# EAGLE design Microport_Dev_Board (EAGLE 8.3.2)

## Sheet 1 of 2
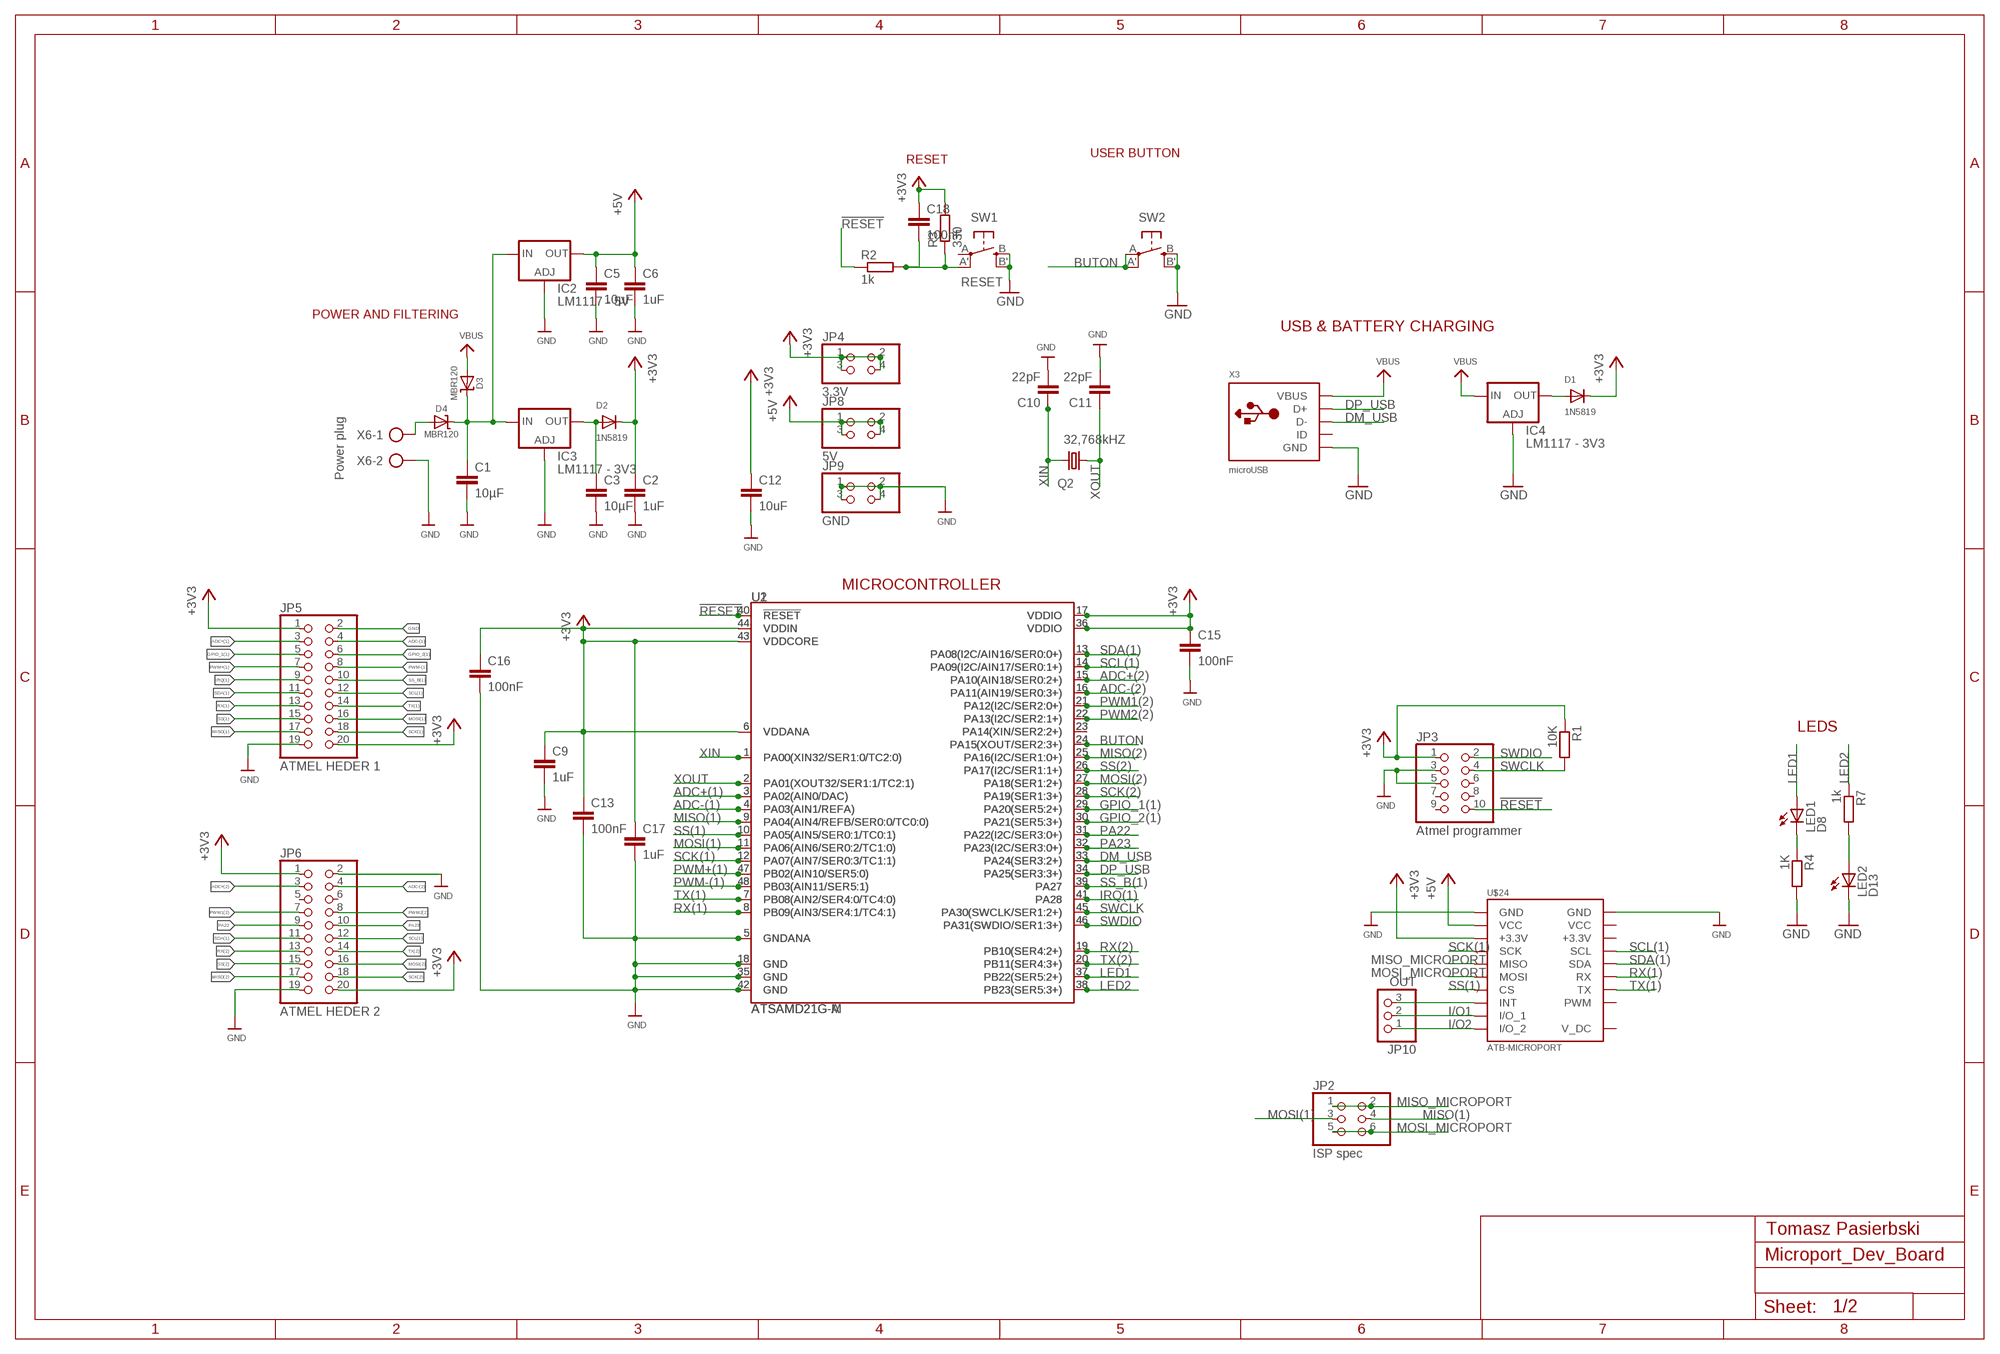
[diagram p0: schematic, sheet 1]

### Parts
C1  10µF  C-EUC1206  [C1206]
C2  1uF  C-EUC1206  [C1206]
C3  10µF  C-EUC1206  [C1206]
C5  10µF  C-EUC1206  [C1206]
C6  1uF  C-EUC1206  [C1206]
C9  1uF  C-EUC1206  [C1206]
C10  22pF  C-EUC1206  [C1206]
C11  22pF  C-EUC1206  [C1206]
C12  10uF  C-EUC1206  [C1206]
C13  100nF  C-EUC1206  [C1206]
C15  100nF  C-EUC1206  [C1206]
C16  100nF  C-EUC1206  [C1206]
C17  1uF  C-EUC1206  [C1206]
C18  100nF  C-EUC1206  [C1206]
D1  1N5819  DIODESOD-523  [SOD-523]
D2  1N5819  DIODESOD-523  [SOD-523]
D3  MBR120  DIODE-SCHOTTKYSOD-123  [SOD-123]
D4  MBR120  DIODE-SCHOTTKYSOD-123  [SOD-123]
IC2  LM1117 - 5V  LD117AS33TR  [SOT223]
IC3  LM1117 - 3V3  LD117AS33TR  [SOT223]
IC4  LM1117 - 3V3  LD117AS33TR  [SOT223]
JP2  ISP spec  PINHD-2X3  [2X03]
JP3  Atmel programmer  PINHD-2X5  [2X05]
JP4  3.3V  PINHD-2X2  [2X02]
JP5  ATMEL HEDER 1  PINHD-2X10  [2X10]
JP6  ATMEL HEDER 2  PINHD-2X10  [2X10]
JP8  5V  PINHD-2X2  [2X02]
JP9  GND  PINHD-2X2  [2X02]
JP10  OUT  PINHD-1X3  [1X03]
LED1  D8  LEDSMT1206  [1206]
LED2  D13  LEDSMT1206  [1206]
Q2  32,768kHZ  CRYSTALHC49UP  [HC49UP]
R1  10K  R-EU_M1206  [M1206]
R2  1k  R-EU_R1206  [R1206]
R3  330  R-EU_R1206  [R1206]
R4  1K  R-EU_M1206  [M1206]
R7  1k  R-EU_M1206  [M1206]
SW1  RESET  SPST_TACT-EVQQ2  [EVQ-Q2]
SW2  USER BUTTON  SPST_TACT-EVQQ2  [EVQ-Q2]
U1  ATSAMD21G-M  [QFN-48]
U2  ATSAMD21G-A  [TQFP-48]
U$24  ATB-MICROPORT  [ATB-MICROPORT]
X3  microUSB  USBMINIB  [USB-MINIB]
X6  Power plug  AK300/2  [AK300/2]

### Nets
!RESET: JP3.10 R2.1 U1.40(!RESET!) U2.40(!RESET!) ; also sheet 2
+3V3: C2.1 C9.1 C12.1 C13.1 C15.1 C16.1 C17.1 C18.1 D1.K(C) D2.K(C) JP3.1 JP4.1 JP4.2 JP4.3 JP4.4 JP5.1 JP5.20 JP6.1 JP6.20 R1.1 R3.2 U1.17(VDDIO) U1.36(VDDIO) U2.6(VDDANA) U2.17(VDDIO) U2.36(VDDIO) U2.43(VDDCORE) U2.44(VDDIN) U$24.P$3(+3.3V) ; also sheet 2
+5V: C5.1 C6.1 IC2.4(OUT) JP8.1 JP8.2 JP8.3 JP8.4 U$24.P$2(VCC) ; also sheet 2
ADC+(1): JP5.3 U1.3(PA02(AIN0/DAC)) U2.3(PA02(AIN0/DAC))
ADC+(2): JP6.3 U1.15(PA10(AIN18/SER0:2+)) U2.15(PA10(AIN18/SER0:2+))
ADC-(1): JP5.4 U1.4(PA03(AIN1/REFA)) U2.4(PA03(AIN1/REFA))
ADC-(2): JP6.4 U1.16(PA11(AIN19/SER0:3+)) U2.16(PA11(AIN19/SER0:3+))
BUTON: SW2.A'(P1) SW2.A(P) U1.24(PA15(XOUT/SER2:3+)) U2.24(PA15(XOUT/SER2:3+))
DM_USB: U1.33(PA24(SER3:2+)) U2.33(PA24(SER3:2+)) X3.D- ; also sheet 2
DP_USB: U1.34(PA25(SER3:3+)) U2.34(PA25(SER3:3+)) X3.D+ ; also sheet 2
GND: C1.2 C2.2 C3.2 C5.2 C6.2 C9.2 C10.2 C11.2 C12.2 C13.2 C15.2 C16.2 C17.2 IC2.1(ADJ) IC3.1(ADJ) IC4.1(ADJ) JP3.3 JP3.5 JP5.2 JP5.19 JP6.2 JP6.19 JP9.1 JP9.2 JP9.3 JP9.4 LED2.C R4.2 SW1.B'(S1) SW1.B(S) SW2.B'(S1) SW2.B(S) U1.5(GNDANA) U1.18(GND) U1.35(GND) U1.42(GND) U2.5(GNDANA) U2.18(GND) U2.35(GND) U2.42(GND) U$24.P$1(GND) U$24.P$19(GND) X3.GND X6.2 ; also sheet 2
GPIO_1(1): JP5.5 U1.29(PA20(SER5:2+)) U2.29(PA20(SER5:2+))
GPIO_2(1): JP5.6 U1.30(PA21(SER5:3+)) U2.30(PA21(SER5:3+))
I/O1: JP10.2 U$24.P$9(I/O_1)
I/O2: JP10.1 U$24.P$10(I/O_2)
IRQ(1): JP5.9 U1.41(PA28) U2.41(PA28)
LED1: LED1.A U1.37(PB22(SER5:2+)) U2.37(PB22(SER5:2+))
LED2: R7.1 U1.38(PB23(SER5:3+)) U2.38(PB23(SER5:3+))
MISO(1): JP2.4 JP5.17 U1.9(PA04(AIN4/REFB/SER0:0/TC0:0)) U2.9(PA04(AIN4/REFB/SER0:0/TC0:0))
MISO(2): JP6.17 U1.25(PA16(I2C/SER1:0+)) U2.25(PA16(I2C/SER1:0+))
MISO_MICROPORT: JP2.1 JP2.2 U$24.P$5(MISO)
MOSI(1): JP2.3 JP5.16 U1.11(PA06(AIN6/SER0:2/TC1:0)) U2.11(PA06(AIN6/SER0:2/TC1:0))
MOSI(2): JP6.16 U1.27(PA18(SER1:2+)) U2.27(PA18(SER1:2+))
MOSI_MICROPORT: JP2.5 JP2.6 U$24.P$6(MOSI)
N$2: LED2.A R7.2
N$3: C1.1 D3.C D4.C IC2.3(IN) IC3.3(IN)
N$5: D1.A IC4.4(OUT)
N$6: LED1.C R4.1
N$8: D4.A X6.1
N$9: C3.1 D2.A IC3.4(OUT)
N$10: C18.2 R2.2 R3.1 SW1.A'(P1)
N$14: JP10.3 U$24.P$8(INT)
N$39: U1.23(PA14(XIN/SER2:2+)) U2.23(PA14(XIN/SER2:2+))
PA22: JP6.9 U1.31(PA22(I2C/SER3:0+)) U2.31(PA22(I2C/SER3:0+))
PA23: JP6.10 U1.32(PA23(I2C/SER3:0+)) U2.32(PA23(I2C/SER3:0+))
PWM1(2): JP6.7 U1.21(PA12(I2C/SER2:0+)) U2.21(PA12(I2C/SER2:0+))
PWM2(2): JP6.8 U1.22(PA13(I2C/SER2:1+)) U2.22(PA13(I2C/SER2:1+))
PWM+(1): JP5.7 U1.47(PB02(AIN10/SER5:0)) U2.47(PB02(AIN10/SER5:0))
PWM-(1): JP5.8 U1.48(PB03(AIN11/SER5:1)) U2.48(PB03(AIN11/SER5:1))
RX(1): JP5.13 U1.8(PB09(AIN3/SER4:1/TC4:1)) U2.8(PB09(AIN3/SER4:1/TC4:1)) U$24.P$14(RX) ; also sheet 2
RX(2): JP6.13 U1.19(PB10(SER4:2+)) U2.19(PB10(SER4:2+))
SCK(1): JP5.18 U1.12(PA07(AIN7/SER0:3/TC1:1)) U2.12(PA07(AIN7/SER0:3/TC1:1)) U$24.P$4(SCK)
SCK(2): JP6.18 U1.28(PA19(SER1:3+)) U2.28(PA19(SER1:3+))
SCL(1): JP5.12 JP6.12 U1.14(PA09(I2C/AIN17/SER0:1+)) U2.14(PA09(I2C/AIN17/SER0:1+)) U$24.P$16(SCL) ; also sheet 2
SDA(1): JP5.11 JP6.11 U1.13(PA08(I2C/AIN16/SER0:0+)) U2.13(PA08(I2C/AIN16/SER0:0+)) U$24.P$15(SDA) ; also sheet 2
SS(1): JP5.15 U1.10(PA05(AIN5/SER0:1/TC0:1)) U2.10(PA05(AIN5/SER0:1/TC0:1)) U$24.P$7(CS)
SS(2): JP6.15 U1.26(PA17(I2C/SER1:1+)) U2.26(PA17(I2C/SER1:1+))
SS_B(1): JP5.10 U1.39(PA27) U2.39(PA27)
SWCLK: JP3.4 R1.2 U1.45(PA30(SWCLK/SER1:2+)) U2.45(PA30(SWCLK/SER1:2+))
SWDIO: JP3.2 U1.46(PA31(SWDIO/SER1:3+)) U2.46(PA31(SWDIO/SER1:3+))
TX(1): JP5.14 U1.7(PB08(AIN2/SER4:0/TC4:0)) U2.7(PB08(AIN2/SER4:0/TC4:0)) U$24.P$13(TX) ; also sheet 2
TX(2): JP6.14 U1.20(PB11(SER4:3+)) U2.20(PB11(SER4:3+))
VBUS: D3.A IC4.3(IN) X3.VBUS ; also sheet 2
XIN: C10.1 Q2.2 U1.1(PA00(XIN32/SER1:0/TC2:0)) U2.1(PA00(XIN32/SER1:0/TC2:0))
XOUT: C11.1 Q2.1 U1.2(PA01(XOUT32/SER1:1/TC2:1)) U2.2(PA01(XOUT32/SER1:1/TC2:1))
Unconnected: JP3.6 JP3.7 JP3.8 JP3.9 JP6.5 JP6.6 SW1.A(P) U1.6(VDDANA) U1.43(VDDCORE) U1.44(VDDIN) U$24.P$12(PWM) X3.ID

### Notes on the sheet
- RESET
- POWER AND FILTERING
- USB & BATTERY CHARGING
- MICROCONTROLLER
- LEDS
- Tomasz Pasierbski

## Sheet 2 of 2
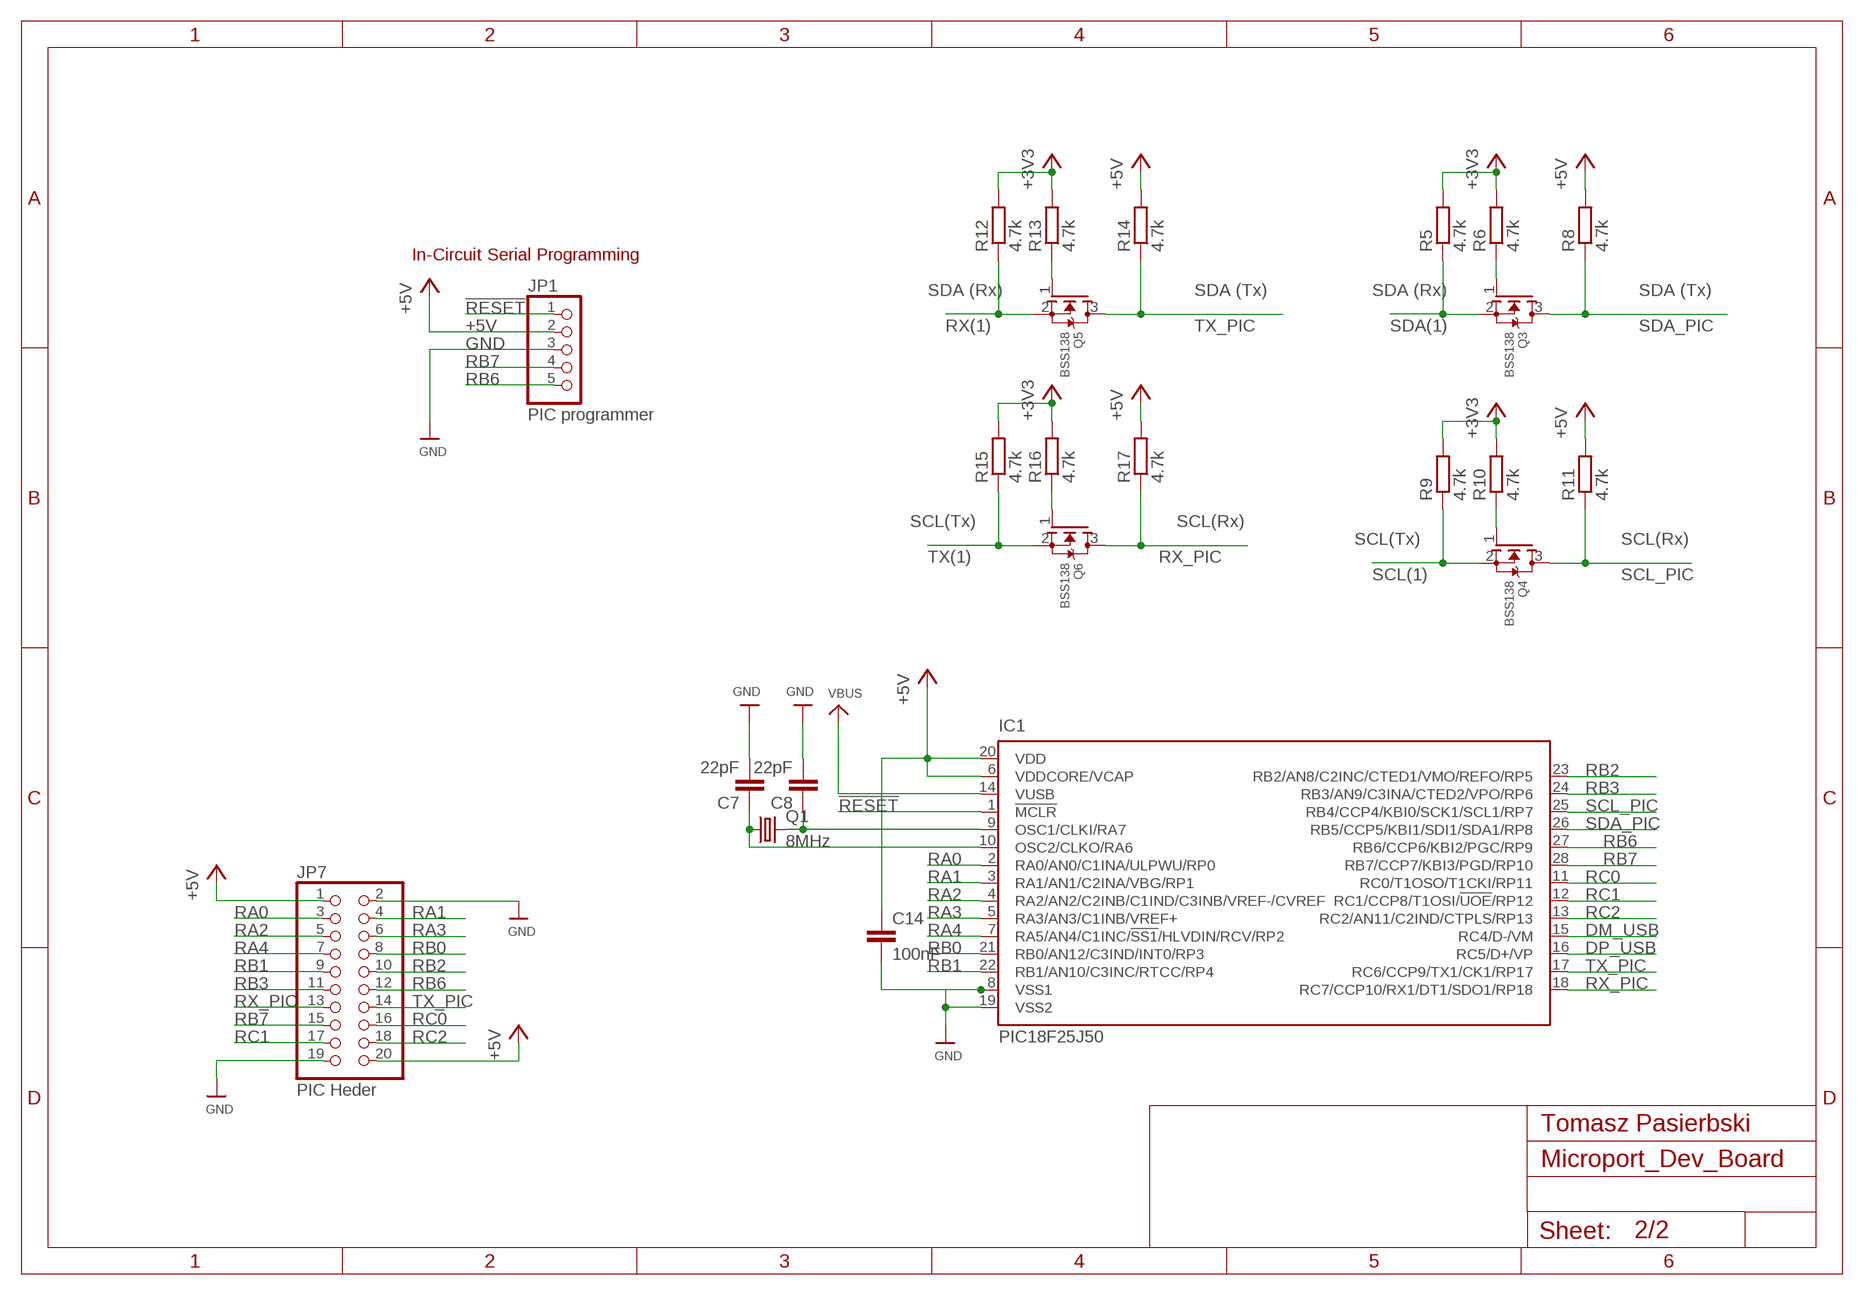
[diagram p1: schematic, sheet 2]

### Parts
C7  22pF  C-EUC1206  [C1206]
C8  22pF  C-EUC1206  [C1206]
C14  100nF  C-EUC1206  [C1206]
IC1  PIC18F25J50  PIC18F26J53SP  [DIL28-3]
JP1  PIC programmer  PINHD-1X5  [1X05]
JP7  PIC Heder  PINHD-2X10  [2X10]
Q1  8MHz  CRYSTALHC49S  [HC49/S]
Q3  BSS138  MOSFET-NWAVE  [SOT23-W]
Q4  BSS138  MOSFET-NWAVE  [SOT23-W]
Q5  BSS138  MOSFET-NWAVE  [SOT23-W]
Q6  BSS138  MOSFET-NWAVE  [SOT23-W]
R5  4.7k  R-EU_R1206  [R1206]
R6  4.7k  R-EU_R1206  [R1206]
R8  4.7k  R-EU_R1206  [R1206]
R9  4.7k  R-EU_R1206  [R1206]
R10  4.7k  R-EU_R1206  [R1206]
R11  4.7k  R-EU_R1206  [R1206]
R12  4.7k  R-EU_R1206  [R1206]
R13  4.7k  R-EU_R1206  [R1206]
R14  4.7k  R-EU_R1206  [R1206]
R15  4.7k  R-EU_R1206  [R1206]
R16  4.7k  R-EU_R1206  [R1206]
R17  4.7k  R-EU_R1206  [R1206]

### Nets
!RESET: IC1.1(!MCLR) JP1.1 ; also sheet 1
+3V3: R5.2 R6.2 R9.2 R10.2 R12.2 R13.2 R15.2 R16.2 ; also sheet 1
+5V: C14.1 IC1.6(VDDCORE/VCAP) IC1.20(VDD) JP1.2 JP7.1 JP7.20 R8.2 R11.2 R14.2 R17.2 ; also sheet 1
DM_USB: IC1.15(RC4/D-/VM) ; also sheet 1
DP_USB: IC1.16(RC5/D+/VP) ; also sheet 1
GND: C7.2 C8.2 C14.2 IC1.8(VSS1) IC1.19(VSS2) JP1.3 JP7.2 JP7.19 ; also sheet 1
N$1: C8.1 IC1.9(OSC1/CLKI/RA7) Q1.2
N$4: C7.1 IC1.10(OSC2/CLKO/RA6) Q1.1
N$26: Q3.1(G) R6.1
N$28: Q4.1(G) R10.1
N$32: Q5.1(G) R13.1
N$34: Q6.1(G) R16.1
RA0: IC1.2(RA0/AN0/C1INA/ULPWU/RP0) JP7.3
RA1: IC1.3(RA1/AN1/C2INA/VBG/RP1) JP7.4
RA2: IC1.4(RA2/AN2/C2INB/C1IND/C3INB/VREF-/CVREF) JP7.5
RA3: IC1.5(RA3/AN3/C1INB/VREF+) JP7.6
RA4: IC1.7(RA5/AN4/C1INC/!SS1!/HLVDIN/RCV/RP2) JP7.7
RB0: IC1.21(RB0/AN12/C3IND/INT0/RP3) JP7.8
RB1: IC1.22(RB1/AN10/C3INC/RTCC/RP4) JP7.9
RB2: IC1.23(RB2/AN8/C2INC/CTED1/VMO/REFO/RP5) JP7.10
RB3: IC1.24(RB3/AN9/C3INA/CTED2/VPO/RP6) JP7.11
RB6: IC1.27(RB6/CCP6/KBI2/PGC/RP9) JP1.5 JP7.12
RB7: IC1.28(RB7/CCP7/KBI3/PGD/RP10) JP1.4 JP7.15
RC0: IC1.11(RC0/T1OSO/T1CKI/RP11) JP7.16
RC1: IC1.12(RC1/CCP8/T1OSI/!UOE!/RP12) JP7.17
RC2: IC1.13(RC2/AN11/C2IND/CTPLS/RP13) JP7.18
RX(1): Q5.2(S) R12.1 ; also sheet 1
RX_PIC: IC1.18(RC7/CCP10/RX1/DT1/SDO1/RP18) JP7.13 Q6.3(D) R17.1
SCL(1): Q4.2(S) R9.1 ; also sheet 1
SCL_PIC: IC1.25(RB4/CCP4/KBI0/SCK1/SCL1/RP7) Q4.3(D) R11.1
SDA(1): Q3.2(S) R5.1 ; also sheet 1
SDA_PIC: IC1.26(RB5/CCP5/KBI1/SDI1/SDA1/RP8) Q3.3(D) R8.1
TX(1): Q6.2(S) R15.1 ; also sheet 1
TX_PIC: IC1.17(RC6/CCP9/TX1/CK1/RP17) JP7.14 Q5.3(D) R14.1
VBUS: IC1.14(VUSB) ; also sheet 1

### Notes on the sheet
- In-Circuit Serial Programming
- SDA (Rx) | SDA (Tx) | SDA (Rx) | SDA (Tx)
- SCL(Tx) | SCL(Rx)
- SCL(Tx) | SCL(Rx)
- Tomasz Pasierbski

## Power pins joined to a net without a drawn wire
+3.3V: U$24.P$17(+3.3V)
V_DC: U$24.P$11(V_DC)
VCC: U$24.P$18(VCC)

## Library data of the parts
C1-C3 C5-C18 = rcl:C-EU: CAPACITOR, European symbol
D1 D2 = adafruit:DIODE: Diode SMADIODE - SMA Surface Mount Package 20V 1A Schottky Diode Digikey: 641-1014-6-ND DO-1N4148 - Through Hole Small Current Diode SOD-123 20V 1 A (.5mV Vf) Schottky Diode - Digikey: MBRX120TPMSCT-ND SOD-323 10V 570mA (.38mV Vf, 3ns) Schottky Diode - Digikey: ZLLS410CT-ND SOD-523 30V 30mA Schottky Diode (RB751S-40TE61) - Digikey: RB751S-40TE61CT-ND SOT23-R/W - SOT23 Package (R = Solder Paste/Reflow Ovens, W = Hand-Soldering) BAT54Film 40V 300mA - Digikey: 497-7162-1-ND
D3 D4 = microbuilder:DIODE-SCHOTTKY
IC1 = microchip:PIC18F2*J53: PIC18F47J53 Family High-Performance USB Microcontrollers with nanoWatt XLP Technology Source: Data sheet <http://ww1.microchip.com/downloads/en/DeviceDoc/39964B.pdf>; MPN: PIC18F26J53-I/SP; OC_FARNELL: unknown; OC_NEWARK: 63R7831
IC2-IC4 = v-reg:LD117A?*: Low drop fixed and adjustable positive voltage regulators 1 A Source: http://www.st.com/stonline/products/literature/ds/7194/ld1117axx.pdf
JP1 = pinhead:PINHD-1X5: PIN HEADER
JP2 = pinhead:PINHD-2X3: PIN HEADER
JP3 = pinhead:PINHD-2X5: PIN HEADER
JP4 JP8 JP9 = pinhead:PINHD-2X2: PIN HEADER
JP5-JP7 = pinhead:PINHD-2X10: PIN HEADER
JP10 = pinhead:PINHD-1X3: PIN HEADER
LED1 LED2 = led:LED: LED OSRAM: - CHIPLED LG R971, LG N971, LY N971, LG Q971, LY Q971, LO R971, LY R971 LH N974, LH R974 LS Q976, LO Q976, LY Q976 LO Q996 - Hyper CHIPLED LW Q18S LB Q993, LB Q99A, LB R99A - SideLED LS A670, LO A670, LY A670, LG A670, LP A670 LB A673, LV A673, LT A673, LW A673 LH A674 LY A675 LS A676, LA A676, LO A676, LY A676, LW A676 LS A679, LY A679, LG A679 - Hyper Micro SIDELED® LS Y876, LA Y876, LO Y876, LY Y876 LT Y87S - SmartLED LW L88C, LW L88S LB L89C, LB L89S, LG L890 LS L89K, LO L89K, LY L89K LS L896, LA L896, LO L896, LY L896 - TOPLED LS T670, LO T670, LY T670, LG T670, LP T670 LSG T670, LSP T670, LSY T670, LOP T670, LYG T670 LG T671, LOG T671, LSG T671 LB T673, LV T673, LT T673, LW T673 LH T674 LS T676, LA T676, LO T676, LY T676, LB T676, LH T676, LSB T676, LW T676 LB T67C, LV T67C, LT T67C, LS T67K, LO T67K, LY T67K, LW E67C LS E67B, LA E67B, LO E67B, LY E67B, LB E67C, LV E67C, LT E67C LW T67C LS T679, LY T679, LG T679 LS T770, LO T770, LY T770, LG T770, LP T770 LB T773, LV T773, LT T773, LW T773 LH T774 LS E675, LA E675, LY E675, LS T675 LS T776, LA T776, LO T776, LY T776, LB T776 LHGB T686 LT T68C, LB T68C - Hyper Mini TOPLED® LB M676 - Mini TOPLED Santana® LG M470 LS M47K, LO M47K, LY M47K Source: http://www.osram.convergy.de LUXEON: - LUMILED® LXK2-PW12-R00, LXK2-PW12-S00, LXK2-PW14-U00, LXK2-PW14-V00 LXK2-PM12-R00, LXK2-PM12-S00, LXK2-PM14-U00 LXK2-PE12-Q00, LXK2-PE12-R00, LXK2-PE12-S00, LXK2-PE14-T00, LXK2-PE14-U00 LXK2-PB12-K00, LXK2-PB12-L00, LXK2-PB12-M00, LXK2-PB14-N00, LXK2-PB14-P00, LXK2-PB14-Q00 LXK2-PR12-L00, LXK2-PR12-M00, LXK2-PR14-Q00, LXK2-PR14-R00 LXK2-PD12-Q00, LXK2-PD12-R00, LXK2-PD12-S00 LXK2-PH12-R00, LXK2-PH12-S00 LXK2-PL12-P00, LXK2-PL12-Q00, LXK2-PL12-R00 Source: www.luxeon.com KINGBRIGHT: KA-3528ASYC Source: www.kingbright.com
Q1 = crystal:CRYSTAL: CRYSTAL; OC_FARNELL: 1667008; OC_NEWARK: unknown
Q2 = crystal:CRYSTAL: CRYSTAL; OC_FARNELL: unknown; OC_NEWARK: unknown
Q3-Q6 = microbuilder:MOSFET-N: N-Channel Mosfet LEGEND VDS: Voltage Drain-Source ID: Drain Current RDS(ON): Drain-Source On-State Resistance VGS(TH): Gate-Source Threshold Voltage CISS: Drain-Source Input Capacitance SOT-23 Name VDS ID RDS(ON) VGS(TH) CISS Order Number 2N7002E 60V 260mA 2.5 Ohm 2.5V @ 250uA 26.7pF @ 25V 2N7002ET1GOSTR-ND BSH103 30V 850mA 400 mOhm 400mV @ 1mA 83pF @ 24V BSH103,235-ND BSS138 60V 320mA 1.6 Ohm 1.5V @ 250uA 50pF @ 10V Mouser: 771-BSS138PW115 DMN2075U-7 20V 4.2A 38 mOhm 1V @ 250 uA 594.3pF @ 10V DMN2075U-7DICT-ND * BSS138 good choice for I2C level-shifting
R1-R17 = rcl:R-EU_: RESISTOR, European symbol
SW1 SW2 = adafruit:SPST_TACT: SMT 6mm switch, EVQQ2 series http://www.ladyada.net/library/eagle
U1 U2 = SparkFun-IC-Microcontroller:ATSAMD21G: Atmel SAMD21G SMART ARM-Based Microcontroller The Atmel ® | SMART ™ SAM D21 is a series of low-power microcontrollers using the 32-bit ARM ® Cortex ® -M0+ processor, and ranging from 32- to 64-pins with up to 256KB Flash and 32KB of SRAM. The SAM D21 devices operate at a maximum frequency of 48MHz and reach 2.46 CoreMark/MHz. They are designed for simple and intuitive migration with identical peripheral modules, hex compatible code, identical linear address map and pin compatible migration paths between all devices in the product series. All devices include intelligent and flexible peripherals, Atmel Event System for inter-peripheral signaling, and support for capacitive touch button, slider and wheel user interfaces. Datasheet <https://cdn.sparkfun.com/datasheets/Dev/Arduino/Boards/Atmel-42181-SAM-D21_Datasheet.pdf> SparkFun Products SparkFun SAMD21 Mini Breakout <https://www.sparkfun.com/products/13664> (DEV-13664) SparkFun SAMD21 Dev Breakout <https://www.sparkfun.com/products/13672> (DEV-13672); PROD_ID: IC-13064
U$24 = ATB-MICROPORT:ATB-MICROPORT
X3 = microbuilder:USB: USB Connectors USBMINIB - Surface Mount Female Mini-B USB Connector 4UConnector: 06564
X6 = con-ptr500:AK300/2: CONNECTOR; OC_FARNELL: unknown; OC_NEWARK: unknown

## Board
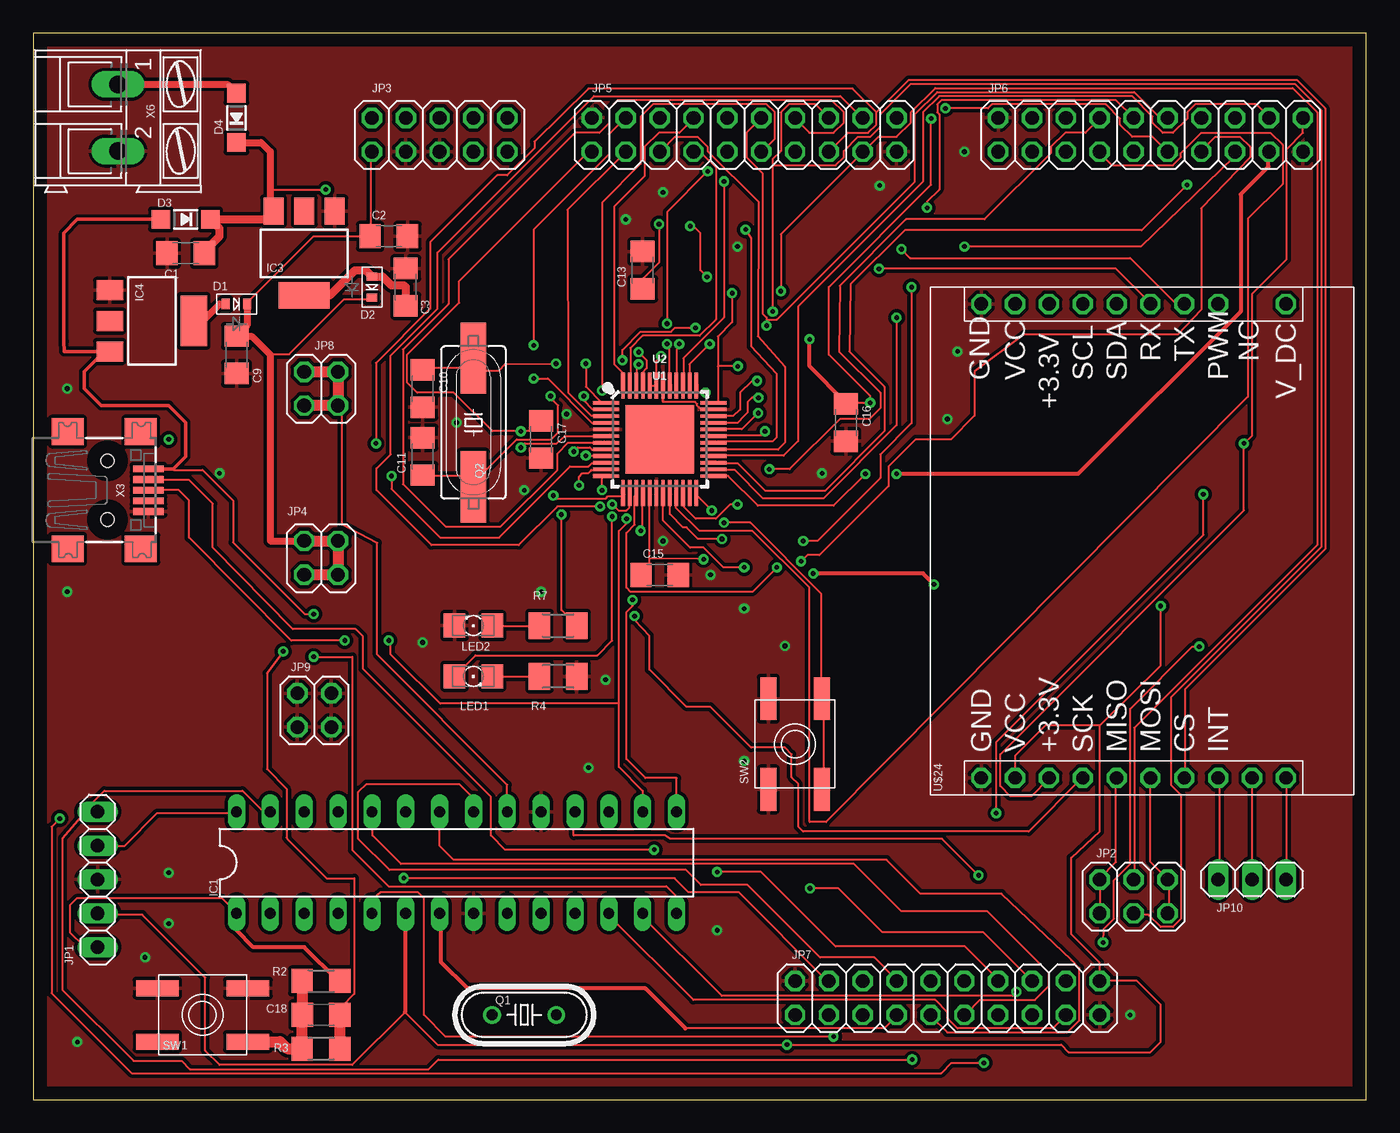
[diagram p2: board, top side]
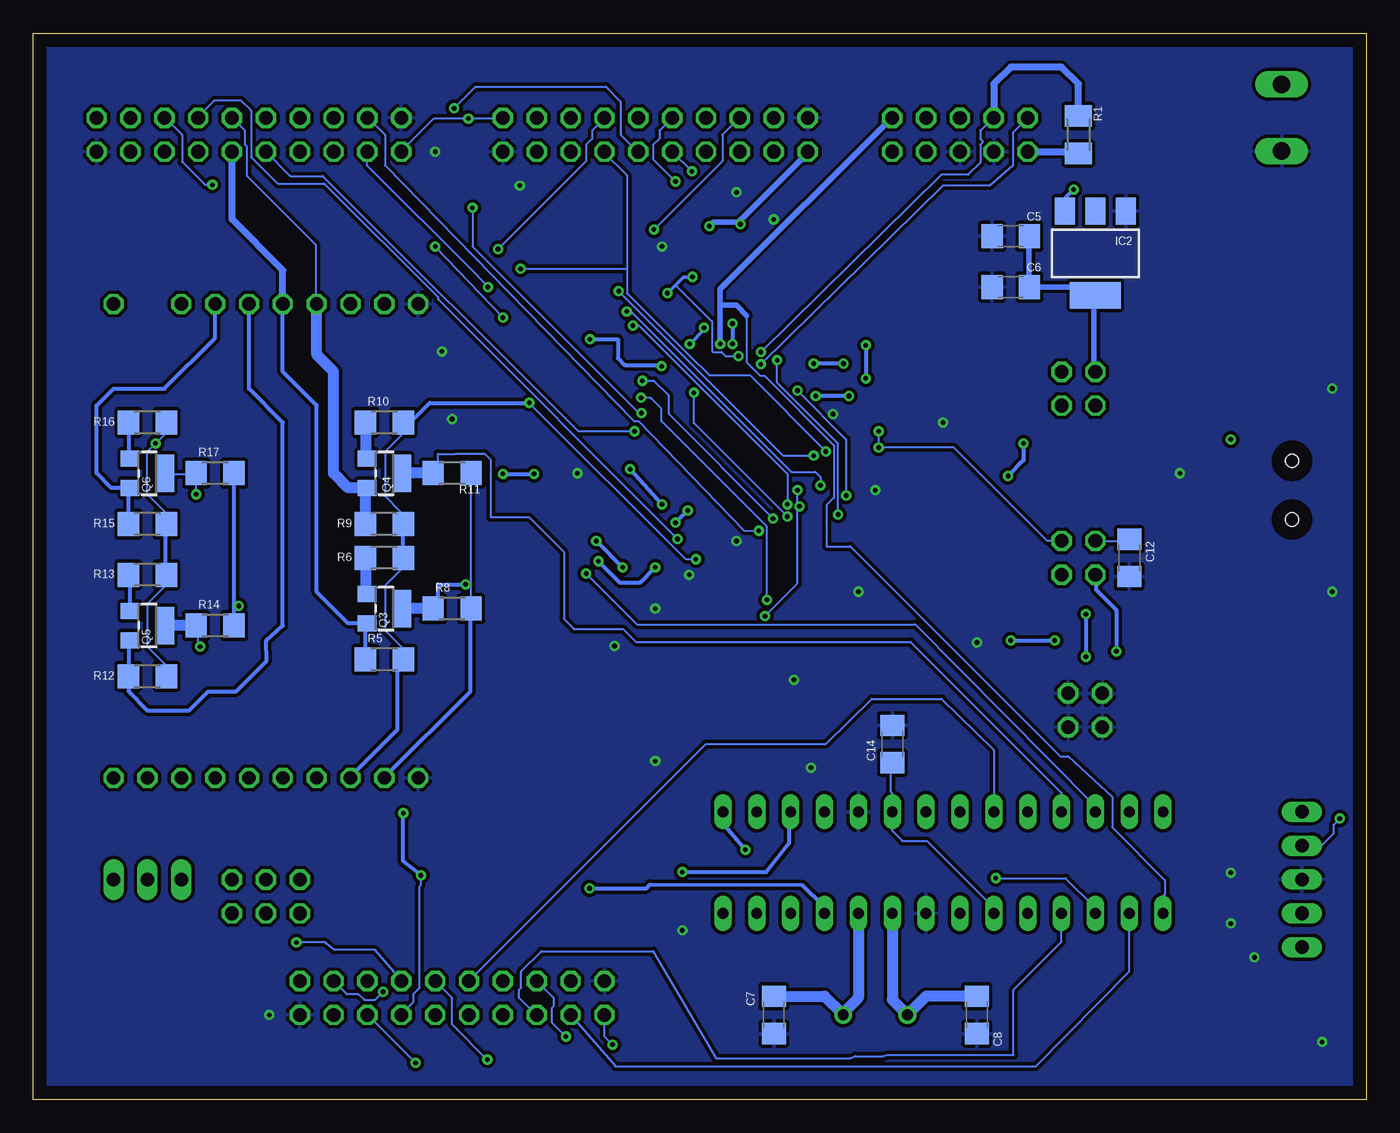
[diagram p3: board, bottom side, seen from below]

Size 100 x 80 mm. Coordinates in mm from the lower left corner, seen from the top.
Outline: 0,0 100,0 100,80 0,80 0,0
Copper layers (1*16): Top 0.035mm / dielectric 1.5mm / Bottom 0.035mm
Design rules "default": minimum track width 6mil, minimum drill 0.35mm, track to track 6mil, track to pad 6mil, pad to pad 6mil, via to via 6mil, smd to smd 6mil, copper to edge 40mil, drill to drill 6mil, minimum pad ring 10mil, minimum via ring 8mil, stop-mask expansion 4mil, vias tented up to drill 0mil, thermal gap 10mil

### Footprints (pad centres in the part's own frame; a part is rotated, then mirrored left to right if it is on the bottom)
C1206 = smd 1.6 x 1.8: 1 -1.4,0; 2 1.4,0
SOD-523 = smd 0.8 x 0.6: A 0,-0.8; K 0,0.8
SOD-123 = smd 1.4 x 1.4: A 1.85,0; C -1.85,0
DIL28-3 = drill 0.813 long: 1 -16.51,-3.81; 2 -13.97,-3.81; 3 -11.43,-3.81; 4 -8.89,-3.81; 5 -6.35,-3.81; 6 -3.81,-3.81; 7 -1.27,-3.81; 8 1.27,-3.81; 9 3.81,-3.81; 10 6.35,-3.81; 11 8.89,-3.81; 12 11.43,-3.81; 13 13.97,-3.81; 14 16.51,-3.81; 15 16.51,3.81; 16 13.97,3.81; 17 11.43,3.81; 18 8.89,3.81; 19 6.35,3.81; 20 3.81,3.81; 21 1.27,3.81; 22 -1.27,3.81; 23 -3.81,3.81; 24 -6.35,3.81; 25 -8.89,3.81; 26 -11.43,3.81; 27 -13.97,3.81; 28 -16.51,3.81
SOT223 = smd 1.5 x 2: 1 -2.3,-3.15; 2 0,-3.15; 3 2.3,-3.15 | smd 3.8 x 2: 4 0,3.15
1X05 = drill 1.016 long: 1 -5.08,0; 2 -2.54,0; 3 0,0; 4 2.54,0; 5 5.08,0
2X03 = drill 1.016 octagon: 1 -2.54,-1.27; 2 -2.54,1.27; 3 0,-1.27; 4 0,1.27; 5 2.54,-1.27; 6 2.54,1.27
2X05 = drill 1.016 octagon: 1 -5.08,-1.27; 2 -5.08,1.27; 3 -2.54,-1.27; 4 -2.54,1.27; 5 0,-1.27; 6 0,1.27; 7 2.54,-1.27; 8 2.54,1.27; 9 5.08,-1.27; 10 5.08,1.27
2X02 = drill 1.016 octagon: 1 -1.27,-1.27; 2 -1.27,1.27; 3 1.27,-1.27; 4 1.27,1.27
2X10 = drill 1.016 octagon: 1 -11.43,-1.27; 2 -11.43,1.27; 3 -8.89,-1.27; 4 -8.89,1.27; 5 -6.35,-1.27; 6 -6.35,1.27; 7 -3.81,-1.27; 8 -3.81,1.27; 9 -1.27,-1.27; 10 -1.27,1.27; 11 1.27,-1.27; 12 1.27,1.27; 13 3.81,-1.27; 14 3.81,1.27; 15 6.35,-1.27; 16 6.35,1.27; 17 8.89,-1.27; 18 8.89,1.27; 19 11.43,-1.27; 20 11.43,1.27
1X03 = drill 1.016 long: 1 -2.54,0; 2 0,0; 3 2.54,0
1206 = smd 1.6 x 1.803: A -1.422,0; C 1.422,0
HC49/S = drill 0.813: 1 -2.413,0; 2 2.413,0
HC49UP = smd 5.334 x 1.93: 1 -4.826,0; 2 4.826,0
SOT23-W = smd 1.2 x 1.4: 1 -1.1,-1.3; 2 1.1,-1.3 | smd 2.8 x 1.4: 3 0,1.3
M1206 = smd 1.6 x 2: 1 -1.4,0; 2 1.4,0
R1206 = smd 1.6 x 1.803: 1 -1.422,0; 2 1.422,0
EVQ-Q2 = smd 3.2 x 1.2: A -3.4,-2; A' 3.4,-2; B -3.4,2; B' 3.4,2
QFN-48 = smd 0.7 x 0.25: 1 -3.4,2.75; 2 -3.4,2.25; 3 -3.4,1.75; 4 -3.4,1.25; 5 -3.4,0.75; 6 -3.4,0.25; 7 -3.4,-0.25; 8 -3.4,-0.75; 9 -3.4,-1.25; 10 -3.4,-1.75; 11 -3.4,-2.25; 12 -3.4,-2.75; 25 3.4,-2.75; 26 3.4,-2.25; 27 3.4,-1.75; 28 3.4,-1.25; 29 3.4,-0.75; 30 3.4,-0.25; 31 3.4,0.25; 32 3.4,0.75; 33 3.4,1.25; 34 3.4,1.75; 35 3.4,2.25; 36 3.4,2.75 | smd 0.25 x 0.7: 13 -2.75,-3.4; 14 -2.25,-3.4; 15 -1.75,-3.4; 16 -1.25,-3.4; 17 -0.75,-3.4; 18 -0.25,-3.4; 19 0.25,-3.4; 20 0.75,-3.4; 21 1.25,-3.4; 22 1.75,-3.4; 23 2.25,-3.4; 24 2.75,-3.4; 37 2.75,3.4; 38 2.25,3.4; 39 1.75,3.4; 40 1.25,3.4; 41 0.75,3.4; 42 0.25,3.4; 43 -0.25,3.4; 44 -0.75,3.4; 45 -1.25,3.4; 46 -1.75,3.4; 47 -2.25,3.4; 48 -2.75,3.4 | smd 5.15 x 5.15: EP 0,0
TQFP-48 = smd 1.5 x 0.28: 1 -4.25,2.75; 2 -4.25,2.25; 3 -4.25,1.75; 4 -4.25,1.25; 5 -4.25,0.75; 6 -4.25,0.25; 7 -4.25,-0.25; 8 -4.25,-0.75; 9 -4.25,-1.25; 10 -4.25,-1.75; 11 -4.25,-2.25; 12 -4.25,-2.75; 25 4.25,-2.75; 26 4.25,-2.25; 27 4.25,-1.75; 28 4.25,-1.25; 29 4.25,-0.75; 30 4.25,-0.25; 31 4.25,0.25; 32 4.25,0.75; 33 4.25,1.25; 34 4.25,1.75; 35 4.25,2.25; 36 4.25,2.75 | smd 0.28 x 1.5: 13 -2.75,-4.25; 14 -2.25,-4.25; 15 -1.75,-4.25; 16 -1.25,-4.25; 17 -0.75,-4.25; 18 -0.25,-4.25; 19 0.25,-4.25; 20 0.75,-4.25; 21 1.25,-4.25; 22 1.75,-4.25; 23 2.25,-4.25; 24 2.75,-4.25; 37 2.75,4.25; 38 2.25,4.25; 39 1.75,4.25; 40 1.25,4.25; 41 0.75,4.25; 42 0.25,4.25; 43 -0.25,4.25; 44 -0.75,4.25; 45 -1.25,4.25; 46 -1.75,4.25; 47 -2.25,4.25; 48 -2.75,4.25
ATB-MICROPORT = drill 1 octagon: P$1 -17.78,11.43; P$2 -17.78,8.89; P$3 -17.78,6.35; P$4 -17.78,3.81; P$5 -17.78,1.27; P$6 -17.78,-1.27; P$7 -17.78,-3.81; P$8 -17.78,-6.35; P$9 -17.78,-8.89; P$10 -17.78,-11.43; P$11 17.78,-11.43; P$12 17.78,-6.35; P$13 17.78,-3.81; P$14 17.78,-1.27; P$15 17.78,1.27; P$16 17.78,3.81; P$17 17.78,6.35; P$18 17.78,8.89; P$19 17.78,11.43
USB-MINIB = smd 0.5 x 2.308: D+ 0,4.064; D- -0.8,4.064; GND 1.6,4.064; ID 0.8,4.064; VBUS -1.6,4.064 | smd 2 x 2.4: GND1 -4.4,-2; GND2 -4.4,3.5; GND3 4.4,3.5; GND4 4.4,-2 | hole 1: -2.2,1; 2.2,1
AK300/2 = drill 1.321 long: 1 -2.515,0; 2 2.489,0

### Placement (x,y rotation side)
C1  11.43,63.5 180 top
C2  26.67,64.77 0 top
C3  27.94,60.96 90 top
C5  26.67,64.77 180 bottom
C6  26.67,60.96 180 bottom
C7  44.45,6.35 270 bottom
C8  29.21,6.35 270 bottom
C9  15.24,55.88 270 top
C10  29.21,53.34 270 top
C11  29.21,48.26 90 top
C12  17.78,40.64 270 bottom
C13  45.72,62.23 90 top
C14  35.56,26.67 90 bottom
C15  46.99,39.37 0 top
C16  60.96,50.8 270 top
C17  38.1,49.53 270 top
C18  21.59,6.35 180 top
D1  15.24,59.69 270 top
D2  25.4,60.96 180 top
D3  11.43,66.04 180 top
D4  15.24,73.66 90 top
IC1  31.75,17.78 0 top
IC2  20.32,63.5 180 bottom
IC3  20.32,63.5 180 top
IC4  8.89,58.42 270 top
JP1  4.83,16.51 90 top
JP2  82.55,15.24 0 top
JP3  30.48,72.39 0 top
JP4  21.59,40.64 0 top
JP5  53.34,72.39 0 top
JP6  83.82,72.39 0 top
JP7  68.58,7.62 0 top
JP8  21.59,53.34 0 top
JP9  21.08,29.21 0 top
JP10  91.44,16.51 180 top
LED1  33.02,31.75 0 top
LED2  33.02,35.56 180 top
Q1  36.83,6.35 180 top
Q2  33.02,50.8 90 top
Q3  73.66,36.83 270 bottom
Q4  73.66,46.99 270 bottom
Q5  91.44,35.56 270 bottom
Q6  91.44,46.99 270 bottom
R1  21.59,72.39 90 bottom
R2  21.59,8.89 180 top
R3  21.59,3.81 0 top
R4  39.37,31.75 0 top
R5  73.66,33.02 0 bottom
R6  73.66,40.64 0 bottom
R7  39.37,35.56 180 top
R8  68.58,36.83 0 bottom
R9  73.66,43.18 0 bottom
R10  73.66,50.8 0 bottom
R11  68.58,46.99 0 bottom
R12  91.44,31.75 0 bottom
R13  91.44,39.37 0 bottom
R14  86.36,35.56 0 bottom
R15  91.44,43.18 0 bottom
R16  91.44,50.8 0 bottom
R17  86.36,46.99 0 bottom
SW1  12.7,6.35 0 top
SW2  57.15,26.67 90 top
U1  46.99,49.53 0 top
U2  46.99,49.53 0 top
U$24  82.55,41.91 90 top
X3  4.57,45.72 270 top
X6  6.35,73.66 270 top

### Tracks (layer width: path | path; a pad name or v marks a point on that pad's centre or on a via)
!RESET  (via drill 0.35)
  Top 0.152: JP1.1 3.81,11.48 2.74,12.55 2.74,14.58 3.25,15.09 14.17,15.09 15.24,14.02 IC1.1 | U1.40 48.31,53.03 48.31,53.65 U2.40 48.26,53.8 48.26,56.26 v48.46,56.69
  Top 0.305: 22.86,8.89 20.32,11.43 16.51,11.43 15.24,12.7 IC1.1
  Top 0.813: R2.1 22.86,8.89
  Bottom 0.152: 35.66,73.61 JP3.10 | IC1.1 15.24,15.24 15.09,15.39 15.09,16.46 19.05,20.42 19.05,22.71 22.35,25.76 22.96,25.76 38.71,41.5 40.49,41.5 40.49,44.6 39.93,45.16 39.93,49.07 45.16,54.3 45.47,54.3 46.48,55.32 46.48,58.83
  Bottom 0.406: 48.46,59.59 48.46,60.81 35.66,73.61 | 48.46,59.59 v48.46,56.69 | 46.48,58.83 47.24,59.59 48.46,59.59
+3V3  (via drill 0.35)
  Top 0.152: U2.44 46.33,53.54 46.63,53.54 U2.43 46.74,53.75 46.74,55.42 v47.09,55.78 | U1.36 50.44,52.27 51.21,52.27 U2.36 51.36,52.27 51.36,55.02 | 51.36,55.02 51.36,57.25 52.43,58.32 v52.43,60.5 | C13.1 45.72,61.57 46.94,62.79 v46.94,65.68 | v36.58,48.92 36.88,49.23 39.27,49.23 39.88,49.78 42.67,49.78 U2.6 | C17.1 38.1,50.9 37.34,50.14 v36.58,50.14 34.44,50.14 31.55,53.03 28.8,53.03 28.04,53.8 28.04,55.88 31.95,59.79 31.95,61.42 41.66,71.12 JP5.1 | JP3.1 25.3,71.02 25.3,64.77 C2.1 21.03,64.77 16.15,59.89 D1.K | D2.K 25.3,60.05 23.32,60.05 19.2,55.93 17.98,55.93 17.78,55.88 | v18.75,33.63 17.53,32 17.53,24.79 19,23.32 19,19.66 19.05,19.56 22,16.61 24.08,16.61 24.08,7.92 23.16,7.01 23.16,6.71 C18.1 | JP6.20 95.25,72.54 94.03,71.32 94.03,63.04 91.44,60.45 91.44,49.84 v90.83,49.23 90.83,44.2 72.54,25.91 72.54,23.52 73.3,22.76 74.88,22.76 76.2,24.08 U$24.P$3 | U1.17 46.33,46.02 46.33,45.41 U2.17 46.23,45.26 46.23,40.59 | 46.23,40.59 46.23,39.98 45.72,39.47 C15.1 | v50.29,40.54 46.23,40.59 | v67.36,73.61 67.36,68.63 59.69,60.96 59.69,55.88 62.79,52.78 v62.79,52.27 60.96,52.27 C16.1 | v52.86,55.02 51.36,55.02 | v50.55,61.72 50.04,62.23 50.04,65.02 49.53,65.53 v49.28,65.53
  Top 0.305: v58.24,57.05 58.24,55.02 60.96,52.27
  Top 0.508: D1.K 16.04,58.08 C9.1 16.38,57.28 17.78,55.88 17.78,41.91 JP4.2
  Top 0.813: JP4.2 JP4.4 JP4.3 JP4.1 | R3.2 23.01,6.33 C18.1
  Bottom 0.152: 41.91,71.02 JP5.1 | v47.09,55.78 48.06,55.78 48.36,56.08 49.02,56.08 49.07,56.13 49.07,58.37 51.82,61.11 | v36.58,50.14 v36.58,48.92 30.94,48.92 23.93,41.91 JP4.4 | JP4.2 17.83,41.91 C12.1 | 20.27,39.32 JP4.1 | R12.2 90.07,31.85 90.07,32.61 91.44,33.98 91.44,37.19 90.07,38.56 90.07,39.32 R13.2 90.07,39.47 | 90.07,43.13 R15.2 90.07,43.28 90.07,44.04 91.44,45.41 91.44,48.62 v90.83,49.23 90.07,49.99 90.07,50.75 R16.2 | 72.24,43.13 R9.2 72.39,43.28 72.39,44.04 73.61,45.26 73.61,48.62 72.39,49.84 72.39,50.75 R10.2 72.24,50.9 71.63,50.9 | 72.24,40.69 R6.2 72.39,40.54 72.39,39.78 73.61,38.56 73.61,35.2 72.39,33.98 72.39,33.07 R5.2 72.39,32.92 | 76.2,24.23 U$24.P$3 | JP6.1 72.39,71.17 69.95,73.61 v67.36,73.61 64.77,73.61 JP5.20 | v50.29,40.54 51.05,40.54 v62.79,52.27 | 52.96,55.12 v52.86,55.02
  Bottom 0.254: v52.43,60.5 51.82,61.11 51.21,61.72 v50.55,61.72
  Bottom 0.305: v18.75,33.63 18.75,36.73 20.27,38.25 20.27,39.32 | 90.07,39.47 90.07,43.13 | 72.24,40.69 72.24,43.13 | 76.2,24.23 72.69,27.74 72.69,32.61 72.39,32.92 | v62.79,52.27 70.26,52.27 71.63,50.9 | v58.24,57.05 56.13,57.05 56.13,55.63 55.63,55.12 52.96,55.12
  Bottom 0.406: 47.09,65.84 41.91,71.02 | 47.09,65.84 v46.94,65.68 | v49.28,65.53 48.97,65.84 47.09,65.84
  Bottom 0.508: JP3.1 21.72,71.12 R1.1
+5V  (via drill 0.35)
  Top 0.152: 80.01,28.07 75.92,28.07 73.66,25.78 U$24.P$2 | 80.01,28.07 80.01,20.12 77.88,18.14 77.88,12.39 80.01,10.26 JP7.20 | 80.01,8.84 JP7.20 | v84.58,37.03 84.58,32.56 80.01,28.07 | JP1.2 5.08,13.87 8.18,13.87 12.9,9.14 12.9,3.66 13.97,2.59 23.93,2.59 27.89,6.55 30.33,4.12 v56.54,4.12 77.11,4.12 77.67,3.56 83.82,3.56 84.58,4.32 84.58,7.11 82.8,8.89 JP7.20 | 27.89,13.87 IC1.6 | IC1.20 35.56,23.62 25.81,33.38 25.81,41.76 23.16,43.13 23.16,51.82 JP8.3
  Top 0.305: 27.89,13.87 27.89,6.55
  Top 0.813: JP8.2 JP8.4 JP8.3 JP8.1
  Bottom 0.152: R11.2 67.21,46.94 67.21,36.88 R8.2 67.21,36.73 | JP7.1 57.15,4.72 v56.54,4.12 | 73.61,24.23 U$24.P$2 | v84.58,37.03 84.94,37.03 | 25.3,60.96 C6.1 | 25.3,64.77 C5.1 | 21.03,60.96 20.42,60.35 IC2.4 20.42,60.2 | 20.42,54.71 JP8.2 | C14.1 35.66,25.15 35.66,23.09 35.56,22.99 IC1.20 35.56,20.17 34.8,19.41 32.97,19.41 28.04,14.48 28.04,14.02 IC1.6
  Bottom 0.305: R14.2 84.94,37.03 R17.2 | 67.21,36.73 67.21,30.63 73.61,24.23
  Bottom 0.406: 25.3,64.77 25.3,60.96 | 21.03,60.96 C6.1 | 20.42,60.2 20.42,54.71
ADC+(1)
  Top 0.152: U1.3 43.59,51.36 42.82,51.36 U2.3 42.77,51.31 41.86,51.31 40.13,53.03 40.08,66.75 JP5.3
ADC+(2)  (via drill 0.35)
  Top 0.152: U1.15 45.26,46.02 45.26,45.41 U2.15 45.11,45.26 45.11,43.13 44.5,42.52 44.5,38.41 44.81,38.1 53.95,38.1 v55.78,39.93 | v57.76,41.91 58.83,41.91 63.55,46.63 63.55,48.41 65.89,50.75 v65.89,60.96
  Bottom 0.152: v65.89,60.96 66.9,62.03 74.98,70.1 74.98,71.02 JP6.3
  Bottom 0.305: v57.76,41.91 v55.78,39.93
ADC-(1)  (via drill 0.35)
  Top 0.152: U1.4 43.59,50.75 42.82,50.75 U2.4 42.82,50.77 41.91,50.77 38.61,54.1 v37.54,54.1 | v37.54,56.59 37.54,65.28 43.18,70.92 43.18,72.44 44.35,73.61 JP5.4
  Bottom 0.305: v37.54,56.59 v37.54,54.1
ADC-(2)  (via drill 0.35)
  Top 0.152: U1.16 45.72,46.02 45.72,45.41 U2.16 45.72,45.26 45.72,42.82 v45.57,42.67
  Bottom 0.152: v45.57,42.67 46.69,42.7 54.61,50.9 54.91,50.9 73.61,70.1 73.61,72.39 74.83,73.61 JP6.4
BUTON  (via drill 0.35)
  Top 0.152: U1.24 49.73,46.02 49.73,45.41 U2.24 49.84,45.26 v50.9,44.2 | v51.82,43.28 53.8,43.28 59.13,37.95 59.13,30.18 SW2.A' 59.28,30.02 59.28,23.32 SW2.A
  Bottom 0.305: v51.82,43.28 v50.9,44.2
DM_USB  (via drill 0.35)
  Top 0.152: U1.33 50.42,50.77 51.18,50.77 U2.33 51.31,50.77 52.83,50.77 53.34,51.31 53.59,51.56 53.59,52.32 53.92,52.65 v54.41,52.65 | v44.96,37.49 44.96,37.03 44.5,36.58 44.5,25.55 45.92,24.13 48.26,24.13 IC1.15 | v46.58,18.75 35.41,18.75 34.34,19.81 34.34,22.71 24.74,32.31 24.74,34.75 24.18,35.31 19.46,35.31 13.46,41.4 13.46,44.7 11.68,46.48 7.92,46.48 X3.D-
  Bottom 0.152: v54.41,52.65 53.67,52.63 52.88,51.84 52.88,50.9 44.96,42.98 v44.96,37.49
  Bottom 0.305: v46.58,18.75 48.16,20.57 48.16,21.49 IC1.15
DP_USB  (via drill 0.35)
  Top 0.152: U1.34 50.44,51.28 51.21,51.28 U2.34 52.5,51.28 53.03,51.77 53.03,53.03 53.92,53.92 v54.3,53.92 | v44.5,43.59 44.5,43.23 43.94,42.67 43.94,29.72 | 43.94,29.72 43.94,24.94 45.72,23.16 IC1.16 | X3.D+ 10.92,45.72 11.68,44.96 11.68,42.16 19.36,34.44 v23.37,34.44 | v26.67,34.44 26.82,34.44 26.82,33.38 27.18,33.02 30.53,29.72 43.94,29.72
  Bottom 0.152: v54.3,53.92 53.42,53.92 52.32,52.83 52.32,51.44 v44.5,43.59
  Bottom 0.305: v26.67,34.44 v23.37,34.44
GND  (via drill 0.35)
  Top 0.152: U1.35 50.12,51.77 49.95,51.93 49.81,52.06 49.81,52.18 49.66,52.33 47.24,52.33 47.24,52.34 U1.42
  other vias: 36.83,45.72 31.75,50.8 59.18,46.99 44.45,66.04 63.5,68.58 69.85,71.12 47.24,41.91 50.8,39.37 53.34,36.83 53.34,25.4 29.21,34.29 38.1,38.1 42.93,31.5 41.66,24.89 2.54,38.1 13.97,46.99 2.54,53.34 40.01,51.44 52.83,64.01 47.24,68.07 82.3,6.35 3.3,4.32 8.38,10.67 10.16,13.21 10.16,17.02 69.34,56.13 68.58,51.05 56.39,34.04 51.31,12.7
  pour Top (isolate 0.254): -2.54,81.28 100.33,81.28 100.33,-1.27 -2.54,-1.27
  pour Bottom (isolate 0.254): -1.27,82.55 101.6,82.55 101.6,-2.54 -1.27,-2.54
GPIO_1(1)
  Top 0.152: U1.29 50.44,48.77 51.21,48.77 U2.29 51.36,48.77 55.88,48.77 56.39,49.28 56.39,54.99 54.36,57.28 54.41,67.36 50.6,71.17 50.6,71.48 49.84,72.24 48.16,72.24 47.09,71.17 JP5.5
GPIO_2(1)  (via drill 0.35)
  Top 0.152: U1.30 50.44,49.38 51.21,49.38 U2.30 51.36,49.38 55.47,49.38 55.75,49.66 55.75,54.48 53.85,56.52 53.85,64.62 v53.44,65.28
  Bottom 0.152: v53.44,65.28 48.31,70.41 48.31,72.39 47.09,73.61 JP5.6
I/O1
  Top 0.152: JP10.2 U$24.P$9
I/O2
  Top 0.152: U$24.P$10 94.03,24.08 94.03,16.61 JP10.1
IRQ(1)  (via drill 0.35)
  Top 0.152: U1.41 47.85,53.03 47.85,53.65 U2.41 47.7,53.8 47.7,56.54 v47.55,56.69 | v47.55,58.22 47.55,66.6 v50.6,69.65
  Bottom 0.152: JP5.9 v50.6,69.65
  Bottom 0.305: v47.55,58.22 v47.55,56.69
LED1  (via drill 0.35)
  Top 0.152: 49.84,53.03 49.84,53.65 U2.37 | v50.44,53.03 49.84,53.03 | v43.43,43.74 43.43,34.44 42.32,33.33 33.17,33.33 31.7,31.85 LED1.A | 49.84,53.03 U1.37
  Bottom 0.152: v50.44,53.03 50.44,50.75 v43.43,43.74
LED2  (via drill 0.35)
  Top 0.152: U1.38 49.23,53.03 49.23,53.65 U2.38 49.23,53.8 49.23,55.17 v50.75,56.69 | v49.68,57.91 48.16,57.91 47.85,57.61 45.57,57.61 44.2,56.24 v44.2,55.47 | v39.62,43.89 39.62,36.73 40.69,35.66 R7.1
  Bottom 0.152: v44.2,55.47 44.2,53.8 39.62,49.23 v39.62,43.89
  Bottom 0.254: v50.75,56.69 49.68,57.76 v49.68,57.91
MISO(1)  (via drill 0.35)
  Top 0.152: U1.9 43.59,48.31 42.82,48.31 U2.9 42.67,48.31 v41.45,48.31 | v56.08,60.66 56.08,64.92 62.18,71.02 JP5.17 62.33,71.17 63.4,72.24 64.77,72.24 65.84,73.3 65.84,74.07 67.67,75.89 94.49,75.89 96.32,74.07 96.32,41.6 82.6,27.89 82.6,16.61 JP2.4
  Bottom 0.152: v41.45,48.31 43.74,48.31 v56.08,60.66
MISO(2)  (via drill 0.35)
  Top 0.152: U1.25 50.44,46.79 51.21,46.79 U2.25 51.36,46.79 52.12,46.79 54.36,44.55 60.05,44.55 v62.43,46.94
  Top 0.305: v64.77,46.94 78.38,46.94 90.58,59.13 90.58,67.92 92.66,70 JP6.17
  Bottom 0.305: v64.77,46.94 v62.43,46.94
MISO_MICROPORT
  Top 0.152: U$24.P$5 81.23,24.08 81.23,17.83 80.01,16.61 JP2.2 JP2.1
MOSI(1)  (via drill 0.35)
  Top 0.152: U1.11 43.59,47.24 42.82,47.24 U2.11 42.67,47.24 41.86,47.24 41.86,47.19 41.66,46.99 41.22,46.99 40.95,46.71 v40.95,46.08 | 55.47,70.1 55.47,70.56 56.08,71.17 56.08,74.07 56.69,74.68 58.67,74.68 JP5.16 | 55.47,70.1 v55.47,59.13 | 55.47,70.1 60.2,70.1 60.81,70.71 60.81,71.17 61.87,72.24 62.79,72.24 63.55,73 63.55,73.91 65.84,76.2 94.64,76.2 96.62,74.22 96.62,41.45 85.34,30.18 85.34,23.62 86.11,22.86 86.11,13.56 85.5,12.95 84.58,12.95 83.67,13.87 82.6,13.87 JP2.3
  Bottom 0.152: v40.95,46.08 40.95,46.71 41.33,47.09 43.13,47.09 55.17,59.13 v55.47,59.13
MOSI(2)  (via drill 0.35)
  Top 0.152: U1.27 50.44,47.85 51.21,47.85 U2.27 51.36,47.7 52.88,47.7 54.91,45.67 59.38,45.67 63.86,50.14 63.86,53.49 61.21,56.13 61.32,61.16 65.38,65.23 83.16,65.23 v86.56,68.63
  Bottom 0.152: v86.56,68.63 87.12,68.63 88.85,70.36 88.85,72.39 90.07,73.61 JP6.16
MOSI_MICROPORT
  Top 0.152: U$24.P$6 83.82,17.83 85.04,16.61 JP2.6 85.19,16.46 85.19,14.02 JP2.5
N$1
  Bottom 0.813: C8.1 33.02,7.75 Q1.2 35.56,7.49 IC1.9
N$2
  Top 0.152: LED2.A 34.44,35.51 37.95,35.51 R7.2
N$3  (via drill 0.35)
  Top 0.152: 17.78,68.28 v21.95,68.28
  Top 0.508: D4.C 17.09,71.81 17.78,71.12 17.78,68.28 17.78,66.89 IC3.3
  Top 0.61: C1.1 12.83,63.63 13.97,64.77 13.97,65.35 D3.C 17.41,66.04 IC3.3
  Bottom 0.152: 22.55,66.75 IC2.3
  Bottom 0.305: 22.55,66.75 22.55,67.67 v21.95,68.28
N$4
  Bottom 0.813: C7.1 40.64,7.75 39.31,6.41 | 39.31,6.41 Q1.1 | IC1.10 38.1,7.62 39.31,6.41
N$5
  Top 0.508: IC4.4 12.7,58.42 13.97,59.69 D1.A
N$6
  Top 0.152: LED1.C 34.44,31.7 37.95,31.7 R4.1
N$8
  Top 0.508: X6.1 14.57,76.17 D4.A
N$9
  Top 0.61: IC3.4 22.25,60.35 24.13,62.23 24.93,62.23 D2.A 26.19,61.76 26.85,61.1 27.8,61.1 27.94,60.96 C3.1
N$10
  Top 0.813: SW1.A' 18.51,4.35 19.05,3.81 R3.1 20.17,6.33 C18.2 20.19,8.87 R2.2
N$13  (via drill 0.35)
  other vias: 10.16,49.53
N$14
  Top 0.152: U$24.P$8 89,24.08 89,16.61 JP10.3
N$26
  Bottom 0.813: R6.1 75.08,38.05 Q3.1
N$28
  Bottom 0.813: R10.1 75.08,48.21 Q4.1
N$32
  Bottom 0.305: Q5.1 92.74,39.25
  Bottom 0.813: 92.91,36.83 Q5.1 | 92.74,39.25 R13.1
N$34
  Bottom 0.305: R16.1 92.86,48.21
  Bottom 0.813: 92.86,48.21 Q6.1
N$39
  Top 0.152: U1.23 49.23,46.02 49.23,45.41 U2.23
PA22  (via drill 0.35)
  Top 0.152: U1.31 50.44,49.84 51.21,49.84 U2.31 51.36,49.84 54.59,49.84 v54.89,50.14
  Bottom 0.152: v54.89,50.14 59.13,50.14 78.28,69.29 80.72,69.29 JP6.9
PA23  (via drill 0.35)
  Top 0.152: U1.32 50.44,50.29 51.21,50.29 U2.32 51.36,50.29 53.16,50.29 v54.38,51.51 | v67.06,66.9 67.06,67.36 67.97,68.28 67.97,73.91 67.82,74.07 67.82,74.68 68.12,74.98 81.23,74.98 JP6.10
  Bottom 0.152: v54.38,51.51 54.56,51.51 67.06,64.01 v67.06,66.9
PWM1(2)
  Top 0.152: U1.21 48.31,46.02 48.31,45.41 U2.21 48.23,44.37 49.99,42.67 53.95,42.67 58.22,38.41 58.22,20.88 58.27,20.83 59.49,20.83 91.14,52.73 91.14,66.09 93.73,68.68 93.73,71.63 92.81,72.54 87.63,72.54 86.11,71.02 86.11,70.71 85.5,70.1 80.92,70.1 80.01,71.02 JP6.7
PWM2(2)  (via drill 0.35)
  Top 0.152: U1.22 48.77,46.02 48.77,45.41 U2.22 48.77,45.26 48.77,44.5 49.68,43.59 51.21,43.59 52.27,44.65 v52.83,44.65 | v55.22,47.3 56.74,47.3 60.5,51.05 62.74,51.05 63.55,51.87 63.55,53.03 60.45,56.13 60.5,61.06 65.48,66.04 71.37,66.04 76.35,71.02 76.35,71.48 77.42,72.54 78.94,72.54 80.01,73.61 JP6.8
  Bottom 0.305: v55.22,47.3 v52.83,44.65
PWM+(1)
  Top 0.152: U1.47 44.81,53.03 44.81,53.65 U2.47 44.81,53.8 44.81,56.39 45.72,57.3 49.99,57.3 51.21,58.52 51.21,69.95 50.14,71.02 49.53,71.02 JP5.7
PWM-(1)
  Top 0.152: U1.48 44.22,52.98 44.22,53.59 U2.48 44.2,53.8 44.2,54.56 43.59,55.17 43.59,67 45.87,69.29 45.87,71.48 46.94,72.54 48.46,72.54 49.53,73.61 JP5.8
RA0
  Bottom 0.152: JP7.3 56.34,2.49 24.79,2.49 17.78,9.63 IC1.2
RA1  (via drill 0.35)
  Top 0.152: v27.79,16.61 48.11,16.61 49.17,15.54 52.93,15.54 59.49,8.99 59.59,8.99 JP7.4
  Bottom 0.152: v27.79,16.61 22.55,16.61 20.42,14.48 20.42,14.02 IC1.3
RA2
  Bottom 0.152: IC1.4 22.86,11.84 26.47,8.23 26.47,3.35 35.92,3.35 36.27,3.25 38.35,3.25 38.71,3.1 48.77,3.1 53.49,11.12 61.87,11.12 63.4,9.6 63.4,8.38 63.55,8.23 63.55,7.62 62.33,6.4 JP7.5
RA3  (via drill 0.35)
  Top 0.152: v60.05,4.72 30.94,4.72 29.31,6.35 29.31,15.09 28.85,15.54 26.06,15.54 25.45,15.01 25.45,14.02 IC1.5
  Bottom 0.152: v60.05,4.72 61.11,5.79 61.11,6.86 60.96,7.01 60.96,7.62 JP7.6
RA4
  Top 0.152: 30.58,13.87 30.48,13.87 IC1.7 | 48.92,5.33 63.86,5.33 64.77,6.25 JP7.7
  Top 0.305: 30.58,13.87 30.58,10.31 32.56,8.33 45.92,8.33 48.92,5.33
RB0
  Top 0.152: IC1.21 33.02,22.61 31.95,23.67 24.99,23.67 24.38,23.06 24.38,19.56 26.72,17.22 48.97,17.22 50.09,16.1 53.59,16.1 59.03,10.67 63.09,10.67 64.77,8.99 JP7.8
RB1
  Top 0.152: IC1.22 30.48,19.05 31.55,17.98 64.01,17.98 66.55,15.44 72.64,15.44 77.88,10.46 78.49,9.86 78.49,5.94 77.57,5.03 68.58,5.03 67.36,6.25 JP7.9
RB2
  Bottom 0.152: JP7.10 49.53,26.67 40.54,26.67 37.08,30.07 31.85,30.07 27.94,26.21 IC1.23
RB3
  Top 0.152: IC1.24 25.45,21.49 25.45,19.81 27.58,17.68 61.57,17.68 65.13,14.12 71.58,14.12 76.2,9.5 76.2,8.53 75.16,7.47 71.02,7.47 69.95,6.4 JP7.11
RB6  (via drill 0.35)
  Top 0.152: IC1.27 17.68,21.64 17.22,21.64 15.7,23.16 5.33,23.16 3.81,21.64 JP1.5 3.81,21.49 2.18,19.61 2.18,8.23 7.52,2.9 11.12,2.9 11.73,2.29 29.67,2.29 30.38,3 v65.94,3
  Bottom 0.152: JP7.12 68.58,7.62 68.58,5.64 v65.94,3
RB7  (via drill 0.35)
  Top 0.152: JP1.4 6.86,19.05 9.3,21.49 15.24,21.49 IC1.28 | v71.32,2.74 68.89,2.74 68.12,1.98 7.37,1.98 1.37,7.98 1.37,20.47 v1.98,21.08
  Bottom 0.152: v71.32,2.74 JP7.15 | v1.98,21.08 2.44,20.62 2.44,19.96 3.35,19.05 JP1.4
RC0  (via drill 0.35)
  Top 0.152: v58.27,15.85 60.4,15.85 63.7,12.55 71.27,12.55 JP7.16
  Bottom 0.152: 40.69,14.48 40.69,14.02
  Bottom 0.305: 40.69,14.48 42.32,16.1 53.72,16.13 54,15.85 v58.27,15.85 | 40.69,14.02 IC1.11
RC1
  Top 0.152: IC1.12 43.28,13.87 43.13,13.87 49.53,7.47 67.67,7.47 68.58,6.55 68.58,6.1 69.34,5.33 76.5,5.33 77.42,6.25 JP7.17
RC2  (via drill 0.35)
  Top 0.152: v73.76,8.08 73.46,7.77 51.66,7.77 45.57,13.87 45.72,13.87 IC1.13
  Bottom 0.152: v73.76,8.08 74.37,7.47 75.16,7.47 75.62,7.92 76.5,7.92 JP7.18
RX(1)  (via drill 0.35)
  Top 0.152: U1.8 43.59,48.77 42.82,48.77 U2.8 42.67,48.77 41.91,48.77 41.76,48.92 40.84,48.92 v40.54,48.62 | v63.45,62.33 81.23,62.33 83.82,59.74 U$24.P$14
  Bottom 0.152: v40.54,48.62 46.23,54.36 49.28,54.36 50.75,55.78 55.47,60.5 55.47,62.33 | 55.47,62.33 55.47,69.34 57.15,71.02 JP5.13 | v63.45,62.33 55.47,62.33
  Bottom 0.305: 92.86,34.34 R12.1 92.86,30.63 91.44,29.21 88.29,29.21 86.88,30.62 84.8,30.62 82.5,32.92 82.53,34.44 81.28,35.56 81.28,50.8 83.82,53.34 U$24.P$14
  Bottom 0.813: 92.86,34.34 Q5.2
RX(2)  (via drill 0.35)
  Top 0.152: U1.19 47.24,46.02 47.24,45.41 U2.19 47.24,45.26 47.24,43.43 49.28,41.4 50.29,41.4 51.77,39.93 v53.34,39.93 | v57.61,40.39 58.06,40.84 58.98,40.84 64.16,46.02 64.16,47.5 66.19,49.53 68.83,49.53 70.61,51.31 70.61,54.61 74.32,57.4 85.85,57.4 87.63,59.26 87.63,66.88 91.29,70.71 91.29,71.48 90.53,72.24 88.7,72.24 87.63,71.17 JP6.13
  Bottom 0.305: v53.34,39.93 54.46,38.81 56.03,38.81 v57.61,40.39
RX_PIC  (via drill 0.35)
  Top 0.152: v70.92,16.82 68.17,19.56 47.75,19.56 47.4,19.81 40.54,19.81 40.54,21.49 40.69,21.49 IC1.18 | v87.78,45.41 87.78,42.37 72.24,26.82 v72.24,21.49
  Bottom 0.152: 87.78,46.94 90.07,46.94 Q6.3 | v70.92,16.82 70.92,16.1 71.02,16 71.02,8.38 71.48,7.92 71.48,7.32 72.39,6.4 JP7.13 | v87.78,45.41 87.78,46.94 | 87.78,46.94 R17.1
  Bottom 0.305: v72.24,21.49 72.24,17.88 v70.92,16.82
SCK(1)  (via drill 0.35)
  Top 0.152: U1.12 42.82,46.79 U2.12 42.67,46.79 v42.67,45.72 | v45.11,36.27 45.11,35.97 46.23,34.8 46.23,32.26 49.02,29.46 50.8,29.46 53.85,26.42 56.39,26.42 56.9,25.91 56.9,24.18 57.4,23.67 57.4,20.47 57.76,20.12 74.68,20.12 78.64,24.08 U$24.P$4 | v42.52,44.5 39.32,44.5 36.42,41.6 29.87,41.6 25.76,45.72 25.76,47.35 26.82,48.41 26.82,55.83 30.33,59.33 30.33,63.55 42.06,75.29 60.55,75.29 62.08,73.76 62.18,73.76 JP5.18
  Bottom 0.152: 42.67,44.5 42.67,38.71 v45.11,36.27 | 42.67,44.5 v42.67,45.72 | 42.67,44.5 v42.52,44.5
SCK(2)
  Top 0.152: U1.28 50.44,48.31 51.21,48.31 U2.28 51.36,48.31 56.29,48.31 57.38,49.4 57.38,59.51 66.75,68.89 66.75,74.07 67.97,75.29 82.45,75.29 83.97,73.76 83.97,73.3 84.73,72.54 85.5,72.54 86.56,73.61 86.56,74.07 87.17,74.68 91.75,74.68 92.66,73.76 JP6.18
SCL(1)  (via drill 0.35)
  Top 0.152: U1.14 44.81,46.02 44.81,45.41 U2.14 44.73,45.34 44.73,44.42 44.5,44.2 43.89,44.2 v43.43,44.65 | 55.02,58.52 55.02,58.67 54.71,58.98 54.71,69.49 53.49,70.71 53.49,72.54 JP5.12 | 55.02,58.52 v55.02,58.06 | 55.02,58.52 55.78,58.52 66.14,68.89 66.14,73.91 67.82,75.59 82.6,75.59 84.43,73.76 85.04,73.76 JP6.12
  Bottom 0.152: JP6.12 84.12,72.69 84.12,71.63 83.97,71.48 83.97,69.29 78.79,64.11 78.79,60.05 U$24.P$16 | v43.43,44.65 43.43,46.94 54.56,58.06 v55.02,58.06
  Bottom 0.813: R9.1 75.08,45.77 Q4.2 76.37,45.89 77.47,46.99 77.47,54.61 78.74,55.88 U$24.P$16
SCL_PIC
  Bottom 0.152: IC1.25 22.86,23.01 34.19,34.34 54.79,34.34 55.75,35.31 59.44,35.31 60.2,36.07 60.2,41.07 62.81,43.69 65.68,43.69 65.68,48.01 66.14,48.46 68.28,48.46 68.35,48.44 69.65,48.44 69.65,46.79 R11.1
  Bottom 0.813: R11.1 Q4.3
SDA(1)  (via drill 0.35)
  Top 0.152: U1.13 44.35,46.02 44.35,45.41 U2.13 44.2,45.26 43.13,45.26 42.98,45.11 39.22,45.11 v39.01,45.31 | v42.67,53.19 42.67,67.31 45.57,70.21 45.57,73.76 46.48,74.68 55.02,74.68 55.63,74.07 55.63,72.08 54.71,71.17 JP5.11 | v68.43,74.37 71.63,74.37 71.93,74.68 80.47,74.68 81.53,73.61 81.53,73.15 82.45,72.24 83.97,72.24 JP6.11
  Bottom 0.152: v39.01,45.31 39.01,49.53 v42.67,53.19 | v68.43,74.37 66.8,76 57.05,76 55.93,74.88 55.93,72.39 54.71,71.17 JP5.11
  Bottom 0.305: R5.1 75.08,35.61 | Q3.2 76.37,35.73 78.74,38.1 78.74,52.07 81.28,54.61 U$24.P$15
  Bottom 0.508: U$24.P$15 81.28,62.23 85.09,66.04 JP6.11
  Bottom 0.813: 75.08,35.61 Q3.2
SDA_PIC  (via drill 0.35)
  Top 0.305: v58.52,39.47 66.75,39.47 v67.56,38.66
  Bottom 0.152: v58.52,39.47 54.71,35.66 33.83,35.66 20.42,22.1 20.42,21.64 IC1.26 | 69.65,37.03 R8.1
  Bottom 0.305: v67.56,38.66 69.65,38.66 69.65,37.03
  Bottom 0.813: R8.1 Q3.3
SS(1)  (via drill 0.35)
  Top 0.152: U1.10 43.59,47.85 42.82,47.85 U2.10 42.77,47.75 41.91,47.75 41.66,47.5 40.26,47.5 34.95,42.16 30.53,42.16 26.87,45.82 v26.87,46.79 | v25.7,49.23 25.7,55.27 29.77,59.33 29.77,64.31 34.8,69.34 35.56,69.34 37.59,71.37 37.59,71.88 41.66,75.84 61.47,75.84 63.25,74.07 | 63.25,74.07 63.25,73.15 62.64,72.54 61.11,72.54 JP5.15 | 63.25,74.07 65.68,76.5 94.79,76.5 96.93,74.37 96.93,41.3 86.41,30.79 86.41,24.23 U$24.P$7
  Bottom 0.152: 26.9,46.79 v26.87,46.79
  Bottom 0.305: v25.7,49.23 25.7,47.98 26.9,46.79
SS(2)  (via drill 0.35)
  Top 0.152: U1.26 50.44,47.24 51.21,47.24 U2.26 51.36,47.24 52.63,47.24 54.76,45.11 59.28,45.11 64.77,50.6 v64.77,58.67 | v69.85,64.01 83.11,64.01 90.07,70.71 90.07,71.02 JP6.15
  Bottom 0.152: v69.85,64.01 v64.77,58.67
SS_B(1)  (via drill 0.35)
  Top 0.152: U1.39 48.77,53.03 48.77,53.65 U2.39 48.77,53.8 48.77,55.63 51.82,58.67 v51.82,68.89
  Bottom 0.152: v51.82,68.89 53.49,70.56 53.49,71.63 53.03,72.08 53.03,72.69 JP5.10
SWCLK  (via drill 0.35)
  Top 0.152: U1.45 45.72,53.03 45.72,53.65 U2.45 45.72,53.8 45.72,54.56 46.02,54.86 46.02,55.47 v45.41,56.08
  Bottom 0.152: v45.41,56.08 31.85,69.39 29.87,69.39 28.96,70.31 28.96,71.63 28.8,71.78 28.8,71.93 28.96,72.08 28.96,72.69 28.04,73.61 JP3.4
  Bottom 0.508: R1.2 21.59,76.2 22.86,77.47 26.67,77.47 27.94,76.2 JP3.4
SWDIO  (via drill 0.35)
  Top 0.152: U1.46 45.26,53.03 45.26,53.65 U2.46 45.26,53.8 45.26,55.02 v45.41,55.17
  Bottom 0.152: v45.41,55.17 31.75,68.58 28.25,68.58 26.52,70.05 26.52,72.54 JP3.2
TX(1)  (via drill 0.35)
  Top 0.152: U1.7 43.59,49.38 42.82,49.38 U2.7 42.55,49.28 40.11,49.28 39.32,48.46 39.32,47.24 35.05,42.98 30.94,42.98 27.74,46.18 27.74,56.29 31.14,59.69 31.14,63.04 40.64,72.54 42.47,72.54 43.18,73.25 43.18,74.32 43.84,74.98 59.89,74.98 60.81,74.07 60.81,73.3 60.05,72.54 58.22,72.54 57.15,73.61 JP5.14 | v65.13,63.8 65.79,63.14 82.3,63.14 85.7,59.74 86.26,59.74 U$24.P$13
  Bottom 0.152: v65.13,63.8 58.52,70.41 58.52,71.63 58.06,72.08 58.06,72.69 57.15,73.61 JP5.14
  Bottom 0.305: R15.1 92.86,45.77 | Q6.2 94.15,45.89 95.25,46.99 95.25,52.07 93.98,53.34 90.17,53.34 86.36,57.15 U$24.P$13
  Bottom 0.813: 92.86,45.77 Q6.2
TX(2)  (via drill 0.35)
  Top 0.152: U1.20 47.85,46.02 47.85,45.41 U2.20 47.75,45.26 47.75,43.92 48.74,42.93 49.02,42.93 49.89,42.06 v51.66,42.06
  Bottom 0.152: v51.66,42.06 69.65,60.05 69.65,60.2 78.18,68.73 81.69,68.73 83.67,70.71 83.67,74.22 84.43,74.98 86.41,74.98 87.63,73.76 JP6.14
TX_PIC  (via drill 0.35)
  Top 0.152: v51.31,17.07 54.61,17.07 60.2,11.48 69.9,11.48 72.39,8.99 JP7.14 | v87.48,33.98 86.97,33.98 82.3,29.31 82.3,17.68 81.08,16.46 81.08,13.56 80.31,12.8 v80.26,11.79
  Bottom 0.152: 43.28,21.49 IC1.17 | v87.48,33.98 87.63,34.14 87.63,35.2 R14.1 | v80.26,11.79 78.08,11.79 77.98,11.68 77.42,11.23 74.37,11.23 72.39,8.99 JP7.14
  Bottom 0.305: 43.28,21.49 43.28,19.25 45.01,17.07 v51.31,17.07
  Bottom 0.813: R14.1 Q5.3
VBUS  (via drill 0.35)
  Top 0.152: v21.03,33.22 23.93,33.22 23.93,18.72 26.64,16 47.5,16 48.21,15.29 48.21,13.99 IC1.14 | v21.03,36.42 20.37,36.42 14.99,41.81 14.99,44.96 12.7,47.24 10.52,47.24 10.49,47.32
  Top 0.254: X3.VBUS 10.49,47.32 11.43,48.26 11.43,50.8 10.16,52.07 5.08,52.07 3.81,53.34 3.81,54.61 5.08,55.88 5.5,55.88 IC4.3 2.3,56.12 2.29,56.9 2.29,65.02 3.3,66.04 D3.A
  Bottom 0.305: v21.03,36.42 v21.03,33.22
XIN  (via drill 0.35)
  Top 0.152: U1.1 42.82,52.27 U2.1 42.67,52.27 41.45,53.49 v41.45,55.22 | v39.22,55.22 35.41,55.19 34.92,54.71 33.98,54.71 33.07,55.63 Q2.2 32.92,55.63 32.16,54.86 29.26,54.86 C10.1
  Bottom 0.305: v39.22,55.22 v41.45,55.22
XOUT  (via drill 0.35)
  Top 0.152: U1.2 43.59,51.82 42.82,51.82 U2.2 42.67,51.82 41.91,51.82 41.3,52.43 v41.3,52.78 | v38.81,52.78 38.81,52.63 39.37,52.07 39.37,50.04 38.86,49.53 36.27,49.53 33.07,46.33 | 33.07,46.33 33.07,46.02 Q2.1 33.07,46.33 | 33.07,46.33 32.61,46.79 29.26,46.79 C11.1
  Bottom 0.305: v38.81,52.78 v41.3,52.78